# EAGLE schematic BT_HC05_v1 (EAGLE 6.4)
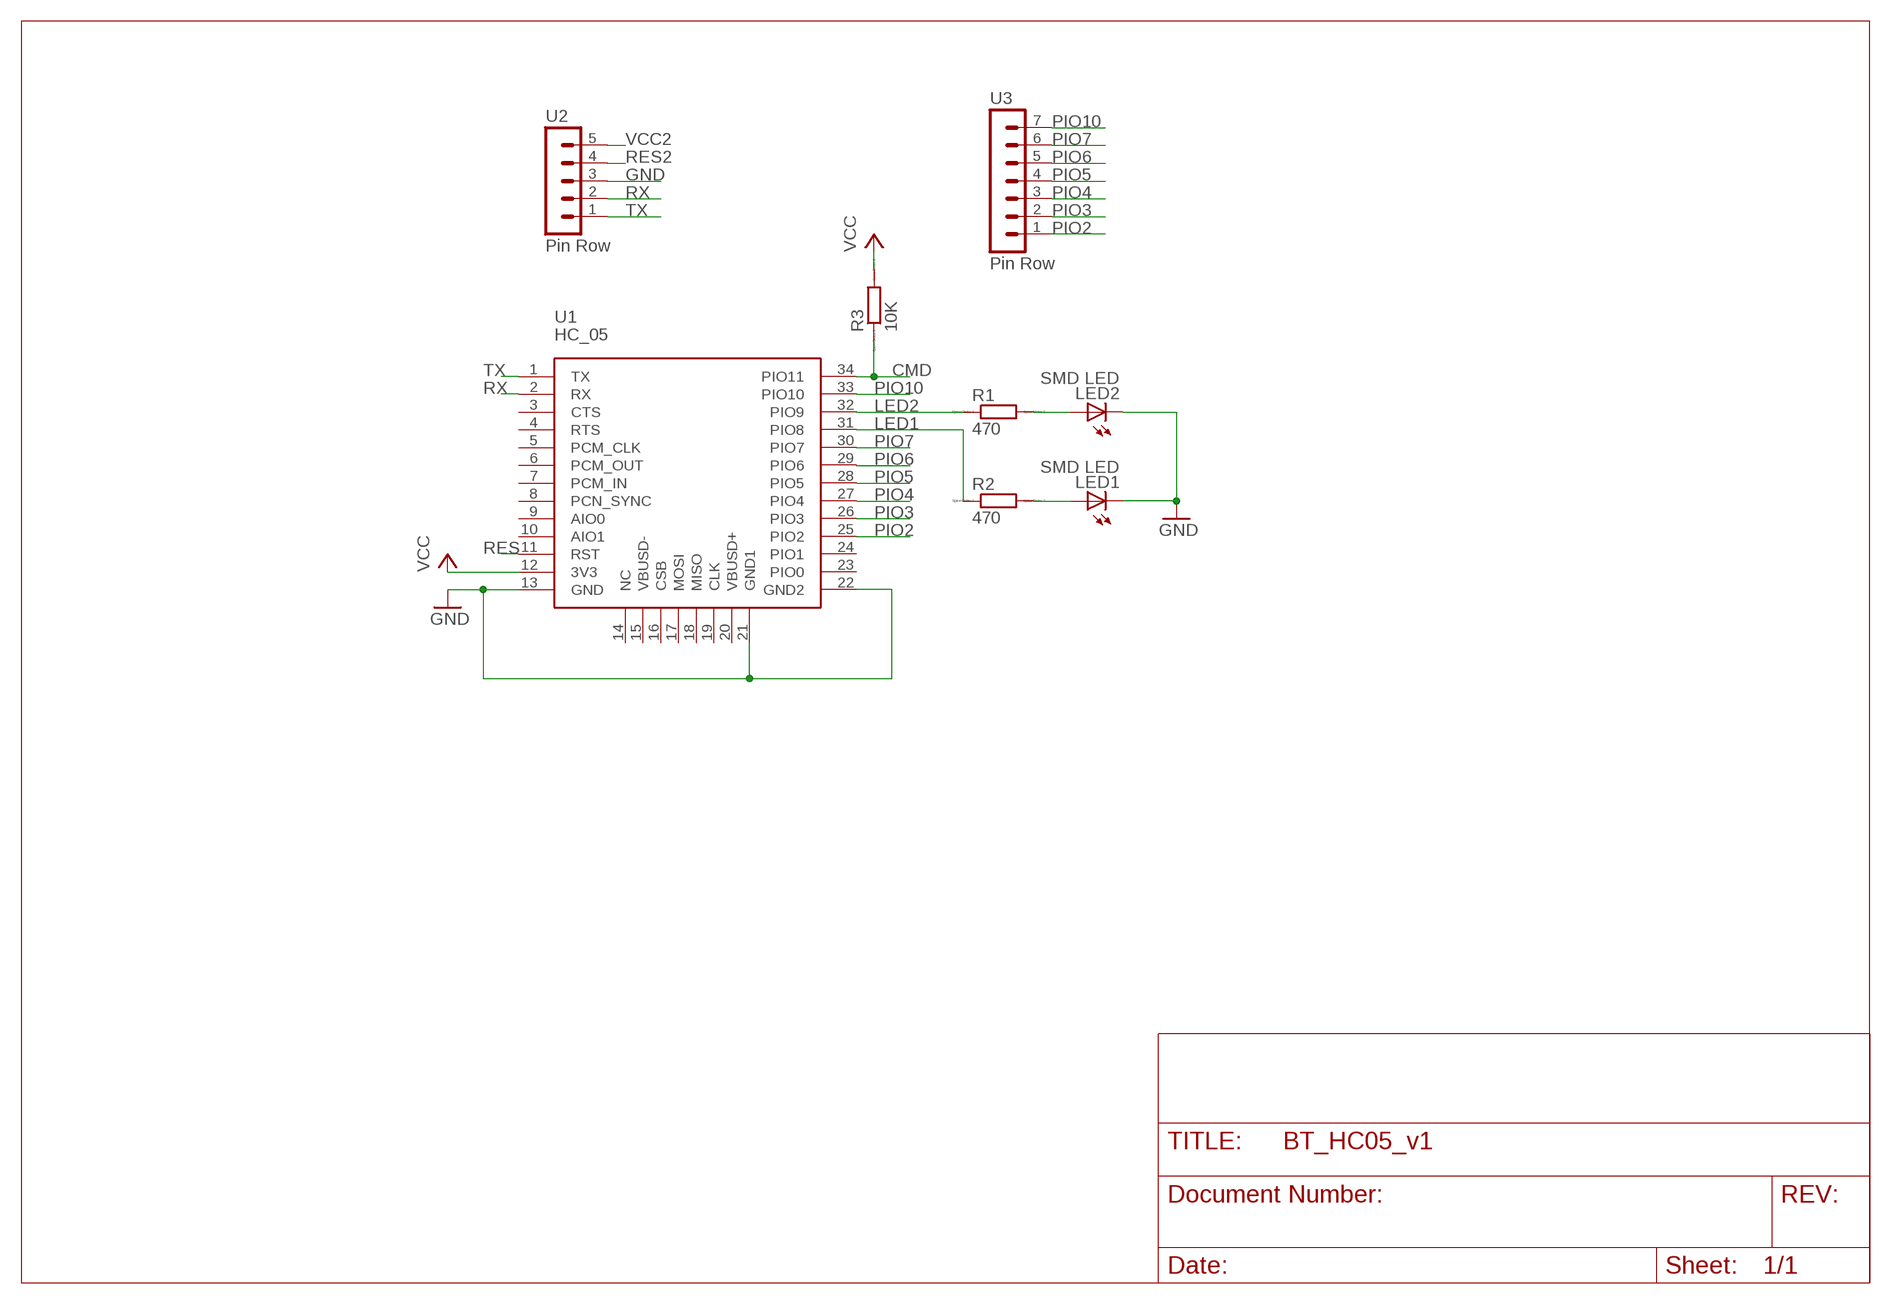
[diagram p0: schematic, sheet 1]

## Parts
LED1  SMD LED  LEDCHIP-LED0805  [CHIP-LED0805]
LED2  SMD LED  LEDCHIP-LED0805  [CHIP-LED0805]
R1  470  R  [R0805]
R2  470  R  [R0805]
R3  10K  R  [R0805]
U1  HC_05  [BLUETOOTH_SMD]
U2  Pin Row  MAR05-1  [MAR05-1]
U3  Pin Row  MA07-1  [MA07-1]

## Nets
CMD: R3.1 U1.34(PIO11)
GND: LED1.C LED2.C U1.13(GND) U1.21(GND1) U1.22(GND2) U2.3
LED1: R2.1 U1.31(PIO8)
LED2: R1.1 U1.32(PIO9)
N$1: LED1.A R2.2
N$3: LED2.A R1.2
PIO2: U1.25(PIO2) U3.1
PIO3: U1.26(PIO3) U3.2
PIO4: U1.27(PIO4) U3.3
PIO5: U1.28(PIO5) U3.4
PIO6: U1.29(PIO6) U3.5
PIO7: U1.30(PIO7) U3.6
PIO10: U1.33(PIO10) U3.7
RES: U1.11(RST)
RES2: U2.4
RX: U1.2(RX) U2.2
TX: U1.1(TX) U2.1
VCC: R3.2 U1.12(3V3)
VCC2: U2.5
Unconnected: U1.3(CTS) U1.4(RTS) U1.5(PCM_CLK) U1.6(PCM_OUT) U1.7(PCM_IN) U1.8(PCN_SYNC) U1.9(AIO0) U1.10(AIO1) U1.14(NC) U1.15(VBUSD-) U1.16(CSB) U1.17(MOSI) U1.18(MISO) U1.19(CLK) U1.20(VBUSD+) U1.23(PIO0) U1.24(PIO1)

## Library data of the parts
LED1 LED2 = led:LED: LED OSRAM: - CHIPLED LG R971, LG N971, LY N971, LG Q971, LY Q971, LO R971, LY R971 LH N974, LH R974 LS Q976, LO Q976, LY Q976 LO Q996 - Hyper CHIPLED LW Q18S LB Q993, LB Q99A, LB R99A - SideLED LS A670, LO A670, LY A670, LG A670, LP A670 LB A673, LV A673, LT A673, LW A673 LH A674 LY A675 LS A676, LA A676, LO A676, LY A676, LW A676 LS A679, LY A679, LG A679 - Hyper Micro SIDELED® LS Y876, LA Y876, LO Y876, LY Y876 LT Y87S - SmartLED LW L88C, LW L88S LB L89C, LB L89S, LG L890 LS L89K, LO L89K, LY L89K LS L896, LA L896, LO L896, LY L896 - TOPLED LS T670, LO T670, LY T670, LG T670, LP T670 LSG T670, LSP T670, LSY T670, LOP T670, LYG T670 LG T671, LOG T671, LSG T671 LB T673, LV T673, LT T673, LW T673 LH T674 LS T676, LA T676, LO T676, LY T676, LB T676, LH T676, LSB T676, LW T676 LB T67C, LV T67C, LT T67C, LS T67K, LO T67K, LY T67K, LW E67C LS E67B, LA E67B, LO E67B, LY E67B, LB E67C, LV E67C, LT E67C LW T67C LS T679, LY T679, LG T679 LS T770, LO T770, LY T770, LG T770, LP T770 LB T773, LV T773, LT T773, LW T773 LH T774 LS E675, LA E675, LY E675, LS T675 LS T776, LA T776, LO T776, LY T776, LB T776 LHGB T686 LT T68C, LB T68C - Hyper Mini TOPLED® LB M676 - Mini TOPLED Santana® LG M470 LS M47K, LO M47K, LY M47K Source: http://www.osram.convergy.de LUXEON: - LUMILED® LXK2-PW12-R00, LXK2-PW12-S00, LXK2-PW14-U00, LXK2-PW14-V00 LXK2-PM12-R00, LXK2-PM12-S00, LXK2-PM14-U00 LXK2-PE12-Q00, LXK2-PE12-R00, LXK2-PE12-S00, LXK2-PE14-T00, LXK2-PE14-U00 LXK2-PB12-K00, LXK2-PB12-L00, LXK2-PB12-M00, LXK2-PB14-N00, LXK2-PB14-P00, LXK2-PB14-Q00 LXK2-PR12-L00, LXK2-PR12-M00, LXK2-PR14-Q00, LXK2-PR14-R00 LXK2-PD12-Q00, LXK2-PD12-R00, LXK2-PD12-S00 LXK2-PH12-R00, LXK2-PH12-S00 LXK2-PL12-P00, LXK2-PL12-Q00, LXK2-PL12-R00 Source: www.luxeon.com KINGBRIGHT: KA-3528ASYC Source: www.kingbright.com
R1-R3 = eagle-ltspice:R: RESISTOR, European symbol; SPICEMODEL: NONE; SPICEPREFIX: R
U1 = SerialPortBluetooth:HC_05: HC-05 Bluetooth Module
U2 = con-lstb:MAR05-1: PIN HEADER; OC_FARNELL: unknown; OC_NEWARK: unknown
U3 = con-lstb:MA07-1: PIN HEADER; OC_FARNELL: unknown; OC_NEWARK: unknown